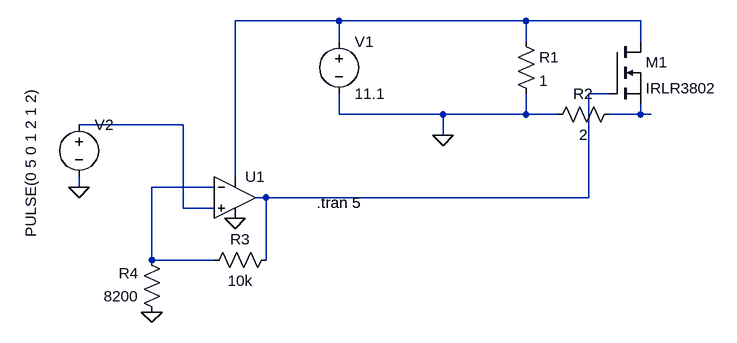
[diagram p0: schematic CurrentShunt_LTSpice.asc]
CurrentShunt_LTSpice.asc, the LTspice schematic file:
Version 4
SHEET 1 880 680
WIRE 32 -32 -128 -32
WIRE 320 -32 32 -32
WIRE 496 -32 320 -32
WIRE 32 0 32 -32
WIRE 320 0 320 -32
WIRE 496 0 496 -32
WIRE 448 80 416 80
WIRE 32 112 32 80
WIRE 192 112 32 112
WIRE 320 112 320 80
WIRE 320 112 192 112
WIRE 368 112 320 112
WIRE 496 112 496 96
WIRE 496 112 448 112
WIRE 512 112 496 112
WIRE -208 128 -368 128
WIRE 192 144 192 112
WIRE -128 208 -128 -32
WIRE -368 224 -368 208
WIRE -160 224 -256 224
WIRE -80 240 -96 240
WIRE 416 240 416 80
WIRE 416 240 -80 240
WIRE -208 256 -208 128
WIRE -160 256 -208 256
WIRE -256 336 -256 224
WIRE -160 336 -256 336
WIRE -80 336 -80 240
FLAG 192 144 0
FLAG -128 272 0
FLAG -256 416 0
FLAG -368 224 0
SYMBOL voltage 32 -16 R0
WINDOW 123 0 0 Left 0
WINDOW 39 0 0 Left 0
SYMATTR InstName V1
SYMATTR Value 11.1
SYMBOL res 304 -16 R0
SYMATTR InstName R1
SYMATTR Value 1
SYMBOL nmos 448 0 R0
SYMATTR InstName M1
SYMATTR Value IRLR3802
SYMBOL res 464 96 R90
WINDOW 0 0 56 VBottom 2
WINDOW 3 32 56 VTop 2
SYMATTR InstName R2
SYMATTR Value 2
SYMATTR SpiceLine pwr=100
SYMBOL Opamps\\UniversalOpamp2 -128 240 R0
SYMATTR InstName U1
SYMBOL res -64 320 R90
WINDOW 0 0 56 VBottom 2
WINDOW 3 32 56 VTop 2
SYMATTR InstName R3
SYMATTR Value 10k
SYMBOL res -240 432 R180
WINDOW 0 36 76 Left 2
WINDOW 3 36 40 Left 2
SYMATTR InstName R4
SYMATTR Value 8200
SYMBOL voltage -368 112 R0
WINDOW 3 -74 -40 VRight 2
WINDOW 123 0 0 Left 0
WINDOW 39 0 0 Left 0
SYMATTR InstName V2
SYMATTR Value PULSE(0 5 0 1 2 1 2)
TEXT -2 248 Left 2 !.tran 5

The netlist it stands for:
* CurrentShunt_LTSpice.asc
V1 N001 0 11.1
R1 N001 0 1
M1 N001 N002 N003 N003 IRLR3802
R2 N003 0 2 pwr=100
XU1 N004 N005 N001 0 N002 level.2 Avol=1Meg GBW=10Meg Slew=10Meg ilimit=25m rail=0 Vos=0 phimargin=45 en=0 enk=0 in=0 ink=0 Rin=500Meg  ; pins IN+ IN- V+ V- OUT
R3 N002 N005 10k
R4 0 N005 8200
V2 N004 0 PULSE(0 5 0 1 2 1 2)
.model NMOS NMOS
.model PMOS PMOS
.lib standard.mos
.tran 5
.lib UniversalOpamps2.sub
.backanno
.end